# Altium project IoT Lock.PrjPcb
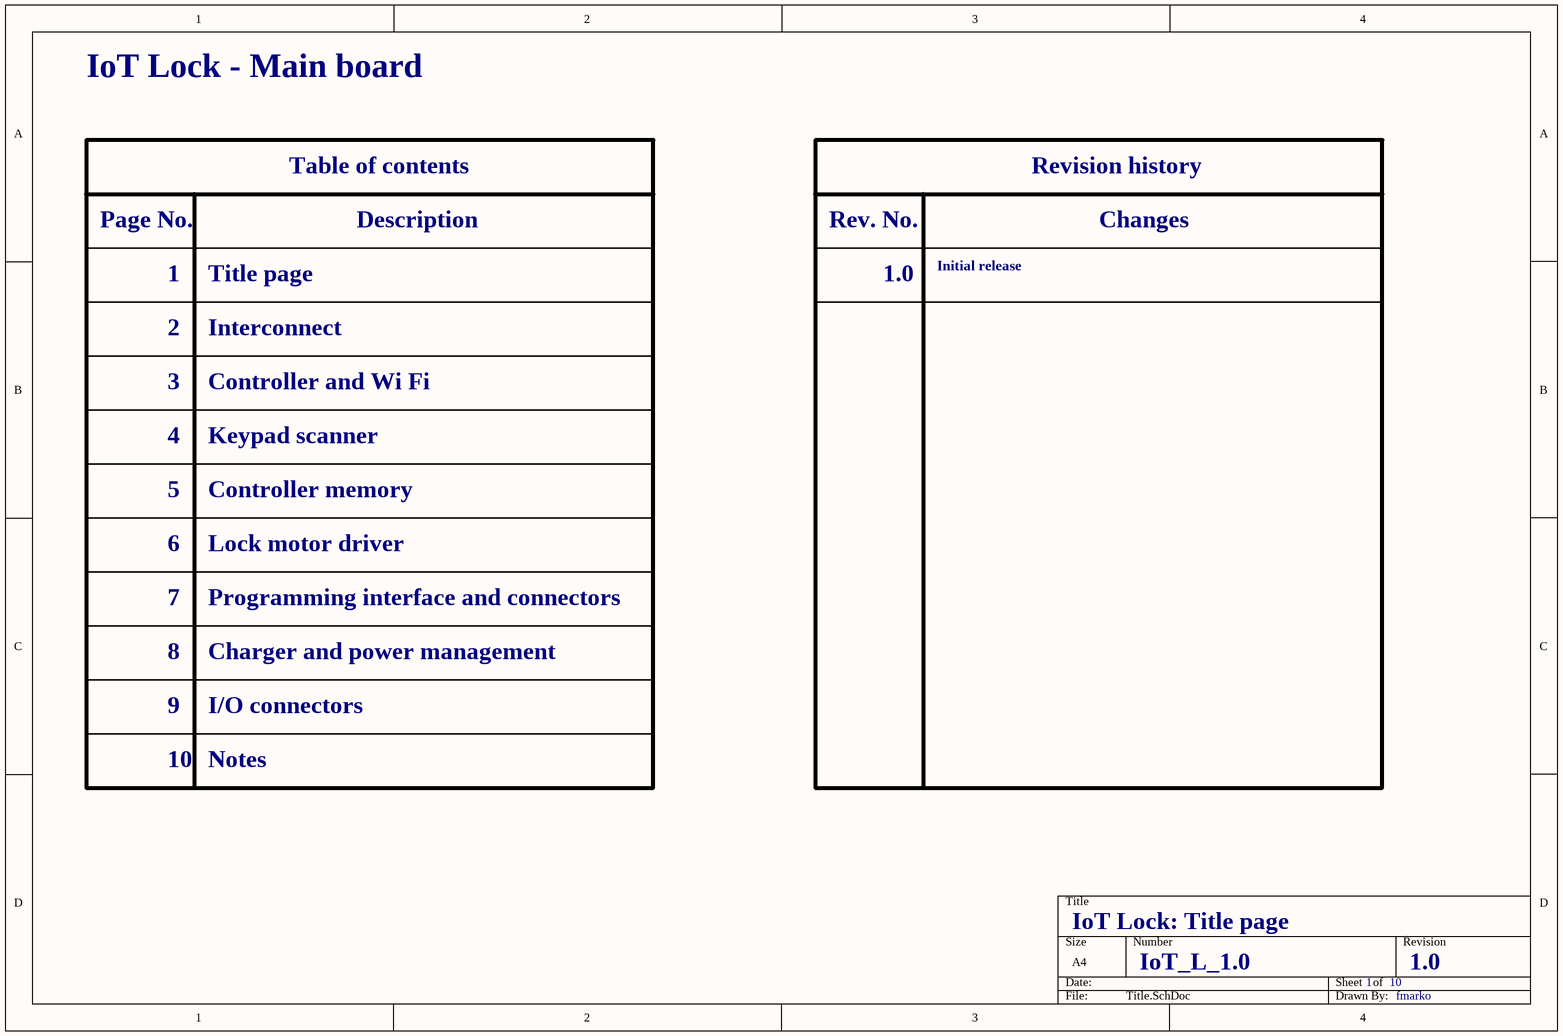
[diagram p0: Title.SchDoc]
10 sheets, 105 parts. Net scope: hierarchical (ports join the sheet entries above them; power ports are global).
Board file: PCB.PcbDoc
Sheets:
  Title.SchDoc
  Interconnect.SchDoc
    SH1 = Controller.SchDoc
    SH2 = Keypad Controller.SchDoc
    SH3 = Memory.SchDoc
    SH4 = Motor driver.SchDoc
    SH5 = Programming interface.SchDoc
    SH6 = Charger.SchDoc
    SH7 = Connectors.SchDoc
  Notes.SchDoc

## Sheet Title.SchDoc
size A4

### Notes on the sheet
- IoT Lock - Main board
- Table of contents
- Revision history
- Page No.
- Description
- Rev. No.
- Changes
- 1
- Title page
- 1.0
- Initial release
- 2
- Interconnect
- 3
- 4
- Controller and Wi Fi
- Keypad scanner
- 5
- Controller memory
- 6
- Lock motor driver
- 7
- Programming interface and connectors
- 8
- 9
- Charger and power management
- I/O connectors
- 10
- Notes
- IoT Lock: Title page
- IoT_L_1.0
- fmarko

## Sheet Interconnect.SchDoc
size A4
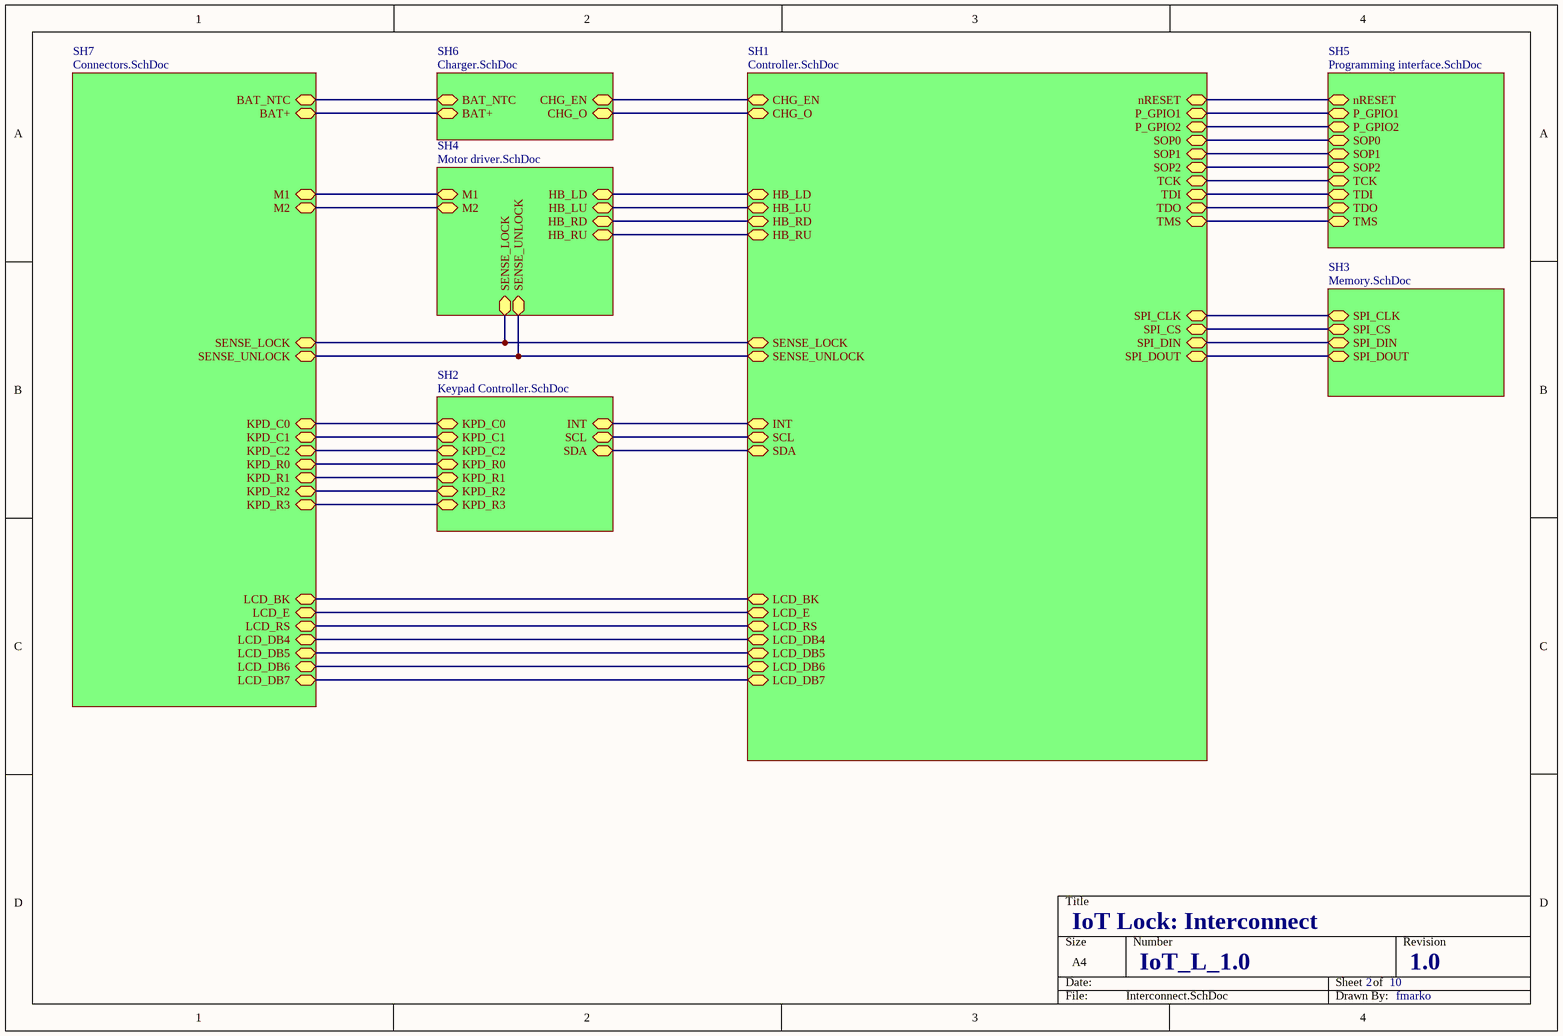
[diagram p1: Interconnect.SchDoc]

### Sub-sheets
SH1 = Controller.SchDoc: CHG_EN, CHG_O, HB_LD, HB_RD, HB_LU, HB_RU, INT, LCD_BK, LCD_DB4, LCD_DB5, LCD_DB6, LCD_DB7, LCD_E, LCD_RS, nRESET, P_GPIO1, P_GPIO2, SCL, SDA, SENSE_LOCK, SENSE_UNLOCK, SOP1, SOP0, SOP2, SPI_CLK, SPI_CS, SPI_DIN, SPI_DOUT, TCK, TDI, TDO, TMS
SH2 = Keypad Controller.SchDoc: INT, KPD_C0, KPD_C1, KPD_C2, KPD_R0, KPD_R1, KPD_R2, KPD_R3, SCL, SDA
SH3 = Memory.SchDoc: SPI_CLK, SPI_CS, SPI_DIN, SPI_DOUT
SH4 = Motor driver.SchDoc: HB_LD, HB_LU, HB_RD, HB_RU, M1, M2, SENSE_LOCK, SENSE_UNLOCK
SH5 = Programming interface.SchDoc: nRESET, P_GPIO1, P_GPIO2, SOP0, SOP2, SOP1, TCK, TDI, TDO, TMS
SH6 = Charger.SchDoc: BAT+, BAT_NTC, CHG_O, CHG_EN
SH7 = Connectors.SchDoc: BAT+, BAT_NTC, KPD_C0, KPD_C1, KPD_R0, KPD_C2, KPD_R1, KPD_R2, KPD_R3, LCD_BK, LCD_DB4, LCD_DB5, LCD_DB6, LCD_DB7, LCD_E, LCD_RS, M1, M2, SENSE_LOCK, SENSE_UNLOCK

### Nets
NetC29_2: sheet SH1/nRESET, sheet SH5/nRESET
NetC33_2: sheet SH6/BAT+, sheet SH7/BAT+
NetP1_3: sheet SH1/SOP0, sheet SH5/SOP0
NetP1_4: sheet SH1/SOP2, sheet SH5/SOP2
NetP1_5: sheet SH1/SOP1, sheet SH5/SOP1
NetP1_6: sheet SH1/P_GPIO2, sheet SH5/P_GPIO2
NetP1_7: sheet SH1/P_GPIO1, sheet SH5/P_GPIO1
NetP2_3: sheet SH1/TMS, sheet SH5/TMS
NetP2_4: sheet SH1/TCK, sheet SH5/TCK
NetP2_5: sheet SH1/TDO, sheet SH5/TDO
NetP2_7: sheet SH1/TDI, sheet SH5/TDI
NetP3_4: sheet SH1/LCD_RS, sheet SH7/LCD_RS
NetP3_6: sheet SH1/LCD_E, sheet SH7/LCD_E
NetP3_11: sheet SH1/LCD_DB4, sheet SH7/LCD_DB4
NetP3_12: sheet SH1/LCD_DB5, sheet SH7/LCD_DB5
NetP3_13: sheet SH1/LCD_DB6, sheet SH7/LCD_DB6
NetP3_14: sheet SH1/LCD_DB7, sheet SH7/LCD_DB7
NetP4_1: sheet SH2/KPD_C2, sheet SH7/KPD_C2
NetP4_2: sheet SH2/KPD_C1, sheet SH7/KPD_C1
NetP4_3: sheet SH2/KPD_C0, sheet SH7/KPD_C0
NetP4_4: sheet SH2/KPD_R0, sheet SH7/KPD_R0
NetP4_5: sheet SH2/KPD_R1, sheet SH7/KPD_R1
NetP4_6: sheet SH2/KPD_R2, sheet SH7/KPD_R2
NetP4_7: sheet SH2/KPD_R3, sheet SH7/KPD_R3
NetP5_2: sheet SH6/BAT_NTC, sheet SH7/BAT_NTC
NetP6_1: sheet SH4/M1, sheet SH7/M1
NetP6_2: sheet SH4/M2, sheet SH7/M2
NetP7_2: sheet SH1/SENSE_LOCK, sheet SH4/SENSE_LOCK, sheet SH7/SENSE_LOCK
NetP8_2: sheet SH1/SENSE_UNLOCK, sheet SH4/SENSE_UNLOCK, sheet SH7/SENSE_UNLOCK
NetR1_1: sheet SH1/INT, sheet SH2/INT
NetR2_1: sheet SH1/SDA, sheet SH2/SDA
NetR3_1: sheet SH1/SCL, sheet SH2/SCL
NetR16_1: sheet SH1/SPI_CS, sheet SH3/SPI_CS
NetR21_1: sheet SH1/HB_LD, sheet SH4/HB_LD
NetR22_2: sheet SH1/HB_RD, sheet SH4/HB_RD
NetR25_1: sheet SH1/CHG_O, sheet SH6/CHG_O
NetR31_1: sheet SH1/LCD_BK, sheet SH7/LCD_BK
NetT1_2: sheet SH1/HB_LU, sheet SH4/HB_LU
NetT2_2: sheet SH1/HB_RU, sheet SH4/HB_RU
NetU1_11: sheet SH1/SPI_CLK, sheet SH3/SPI_CLK
NetU1_12: sheet SH1/SPI_DOUT, sheet SH3/SPI_DOUT
NetU1_13: sheet SH1/SPI_DIN, sheet SH3/SPI_DIN
NetU1_50: sheet SH1/CHG_EN, sheet SH6/CHG_EN

### Notes on the sheet
- IoT Lock: Interconnect
- IoT_L_1.0
- 2
- 10
- 1.0
- fmarko

## Sheet Controller.SchDoc
size A4
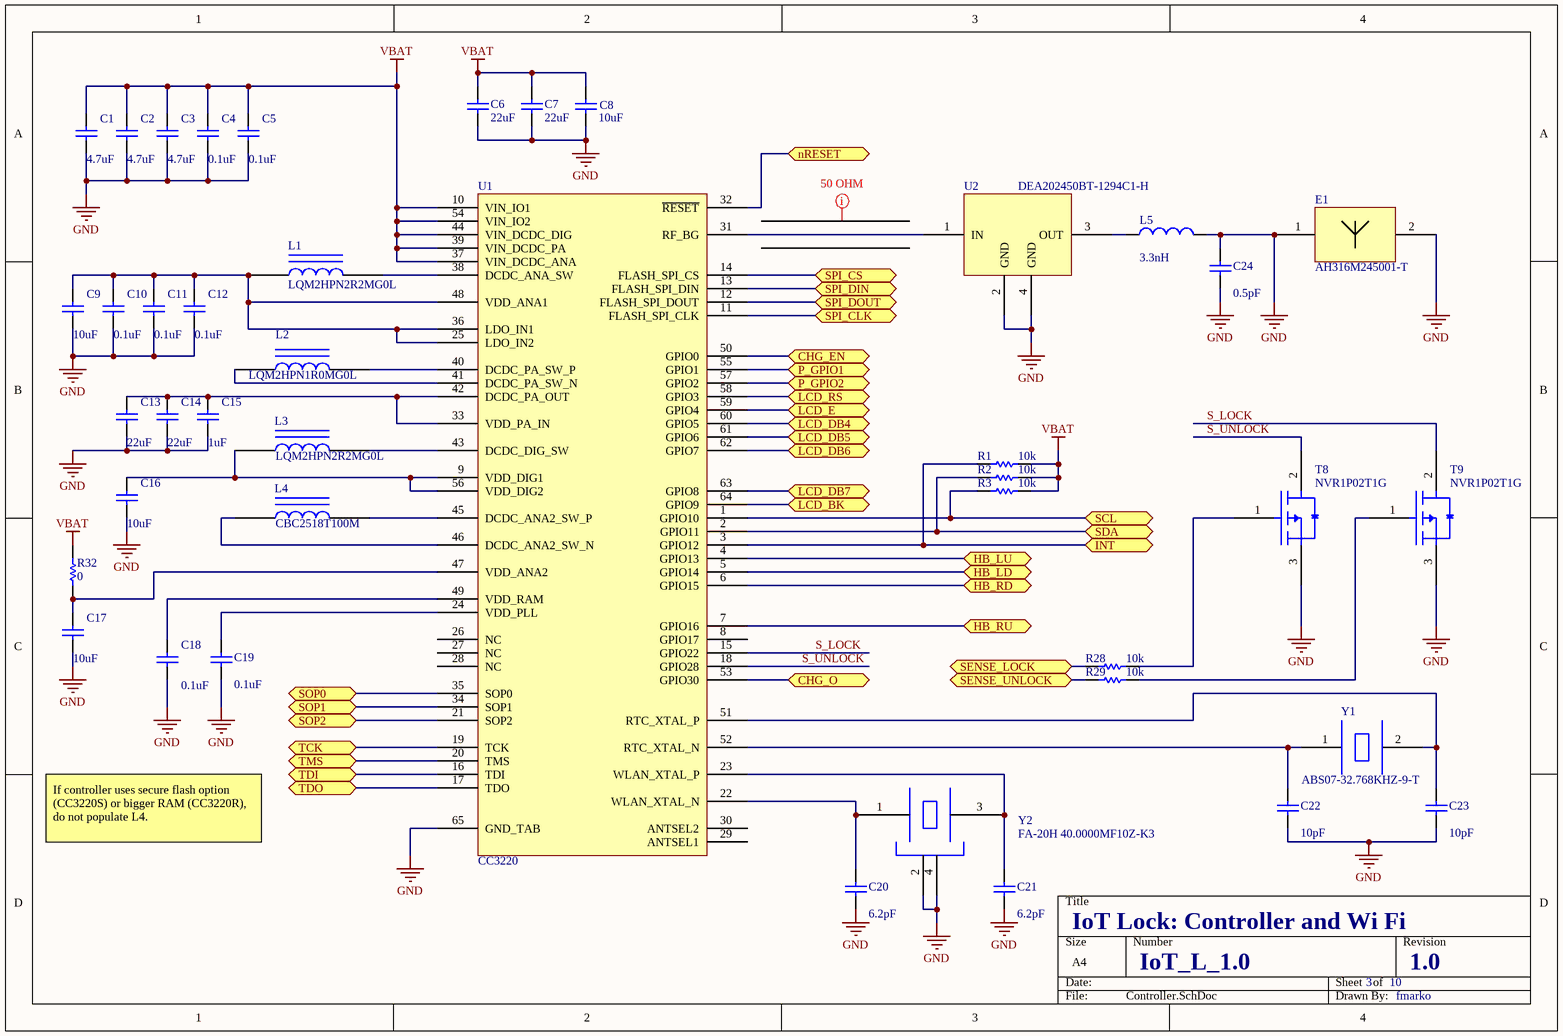
[diagram p2: Controller.SchDoc]

### Parts
C1  value 4.7uF  [0402]  (hidden comment: GRM1555C1HR50BA01D)
C2  value 4.7uF  [0402]  (hidden comment: GRM1555C1HR50BA01D)
C3  value 4.7uF  [0402]  (hidden comment: GRM1555C1HR50BA01D)
C4  value 0.1uF  [0402]  (hidden comment: GRM1555C1HR50BA01D)
C5  value 0.1uF  [0402]  (hidden comment: GRM1555C1HR50BA01D)
C6  value 22uF  [1608[0603]]  (hidden comment: GRM1555C1HR50BA01D)
C7  value 22uF  [1608[0603]]  (hidden comment: GRM1555C1HR50BA01D)
C8  value 10uF  [1608[0603]]  (hidden comment: GRM1555C1HR50BA01D)
C9  value 10uF  [1608[0603]]  (hidden comment: GRM1555C1HR50BA01D)
C10  value 0.1uF  [0402]  (hidden comment: GRM1555C1HR50BA01D)
C11  value 0.1uF  [0402]  (hidden comment: GRM1555C1HR50BA01D)
C12  value 0.1uF  [0402]  (hidden comment: GRM1555C1HR50BA01D)
C13  value 22uF  [1608[0603]]  (hidden comment: GRM1555C1HR50BA01D)
C14  value 22uF  [1608[0603]]  (hidden comment: GRM1555C1HR50BA01D)
C15  value 1uF  [0402]  (hidden comment: GRM1555C1HR50BA01D)
C16  value 10uF  [1608[0603]]  (hidden comment: GRM1555C1HR50BA01D)
C17  value 10uF  [1608[0603]]  (hidden comment: GRM1555C1HR50BA01D)
C18  value 0.1uF  [0402]  (hidden comment: GRM1555C1HR50BA01D)
C19  value 0.1uF  [0402]  (hidden comment: GRM1555C1HR50BA01D)
C20  value 6.2pF  [0402]  (hidden comment: GRM1555C1HR50BA01D)
C21  value 6.2pF  [0402]  (hidden comment: GRM1555C1HR50BA01D)
C22  value 10pF  [0402]  (hidden comment: GRM1555C1HR50BA01D)
C23  value 10pF  [0402]  (hidden comment: GRM1555C1HR50BA01D)
C24  value 0.5pF  [0402]  (hidden comment: GRM1555C1HR50BA01D)
E1  AH316M245001-T  [AH316M245001-T]
L1  LQM2HPN2R2MG0L  [INDC2520X10N]
L2  LQM2HPN1R0MG0L  [INDC2520X10N]
L3  LQM2HPN2R2MG0L  [INDC2520X10N]
L4  CBC2518T100M  [INDC2518X20N]
L5  value 3.3nH  [0402-A]  (hidden comment: LQG15HS3N3S02D)
R1  value 10k  [0402]  (hidden comment: Res Semi)
R2  value 10k  [0402]  (hidden comment: Res Semi)
R3  value 10k  [0402]  (hidden comment: Res Semi)
R28  value 10k  [0402]  (hidden comment: Res Semi)
R29  value 10k  [0402]  (hidden comment: Res Semi)
R32  value 0  [0402]  (hidden comment: Res Semi)
T8  NVR1P02T1G  [SOT95P237X111-3N]
T9  NVR1P02T1G  [SOT95P237X111-3N]
U1  CC3220  [PQFN50P900X900X100_HS-65N]
U2  DEA202450BT-1294C1-H  [DEA202450BT-1294C1-H_LAYOUT]
Y1  ABS07-32.768KHZ-9-T  [ABS07-32.768KHZ-9-T_HS]
Y2  FA-20H 40.0000MF10Z-K3  [FA-20H 40.0000MF10Z-K3_HS]

### Ports
CHG_EN, CHG_O, HB_LD, HB_LU, HB_RD, HB_RU, INT, LCD_BK, LCD_DB4, LCD_DB5, LCD_DB6, LCD_DB7, LCD_E, LCD_RS, nRESET, P_GPIO1, P_GPIO2, SCL, SDA, SENSE_LOCK, SENSE_UNLOCK, SOP0, SOP1, SOP2, SPI_CLK, SPI_CS, SPI_DIN, SPI_DOUT, TCK, TDI, TDO, TMS

### Nets
GND: C1.1 C2.1 C3.1 C4.1 C5.1 C6.1 C7.1 C8.1 C9.1 C10.1 C11.1 C12.1 C13.1 C14.1 C15.1 C16.1 C17.1 C18.1 C19.1 C20.1 C21.1 C22.1 C23.1 C24.1 C24.2 E1.1 E1.2 L5.2 T8.3(D) T9.3(D) U1.65(GND_TAB) U2.2(GND) U2.4(GND) Y2.2 Y2.4
VBAT: C1.2 C2.2 C3.2 C4.2 C5.2 C6.2 C7.2 C8.2 R1.2 R2.2 R3.2 R32.2 U1.10(VIN_IO1) U1.37(VIN_DCDC_ANA) U1.39(VIN_DCDC_PA) U1.44(VIN_DCDC_DIG) U1.54(VIN_IO2)
S_LOCK: T9.2(S) U1.15(GPIO22)
S_UNLOCK: T8.2(S) U1.18(GPIO28)
NetC9_2: C9.2 C10.2 C11.2 C12.2 L1.1 U1.25(LDO_IN2) U1.36(LDO_IN1) U1.48(VDD_ANA1)
NetC13_2: C13.2 C14.2 C15.2 U1.33(VDD_PA_IN) U1.42(DCDC_PA_OUT)
NetC16_2: C16.2 L3.1 U1.9(VDD_DIG1) U1.56(VDD_DIG2)
NetC17_2: C17.2 R32.1 U1.47(VDD_ANA2)
NetC18_2: C18.2 U1.49(VDD_RAM)
NetC19_2: C19.2 U1.24(VDD_PLL)
NetC20_2: C20.2 U1.22(WLAN_XTAL_N) Y2.1
NetC21_2: C21.2 U1.23(WLAN_XTAL_P) Y2.3
NetC22_2: C22.2 U1.52(RTC_XTAL_N) Y1.1
NetC23_2: C23.2 U1.51(RTC_XTAL_P) Y1.2
NetC29_2: U1.32(~{RESET}) ; port nRESET
NetL1_2: L1.2 U1.38(DCDC_ANA_SW)
NetL2_1: L2.1 U1.41(DCDC_PA_SW_N)
NetL2_2: L2.2 U1.40(DCDC_PA_SW_P)
NetL3_2: L3.2 U1.43(DCDC_DIG_SW)
NetL4_1: L4.1 U1.46(DCDC_ANA2_SW_N)
NetL4_2: L4.2 U1.45(DCDC_ANA2_SW_P)
NetL5_1: L5.1 U2.3(OUT)
NetP1_3: U1.35(SOP0) ; port SOP0
NetP1_4: U1.21(SOP2) ; port SOP2
NetP1_5: U1.34(SOP1) ; port SOP1
NetP1_6: U1.57(GPIO2) ; port P_GPIO2
NetP1_7: U1.55(GPIO1) ; port P_GPIO1
NetP2_3: U1.20(TMS) ; port TMS
NetP2_4: U1.19(TCK) ; port TCK
NetP2_5: U1.17(TDO) ; port TDO
NetP2_7: U1.16(TDI) ; port TDI
NetP3_4: U1.58(GPIO3) ; port LCD_RS
NetP3_6: U1.59(GPIO4) ; port LCD_E
NetP3_11: U1.60(GPIO5) ; port LCD_DB4
NetP3_12: U1.61(GPIO6) ; port LCD_DB5
NetP3_13: U1.62(GPIO7) ; port LCD_DB6
NetP3_14: U1.63(GPIO8) ; port LCD_DB7
NetP7_2: R28.1 ; port SENSE_LOCK
NetP8_2: R29.1 ; port SENSE_UNLOCK
NetR1_1: R1.1 U1.3(GPIO12) ; port INT
NetR2_1: R2.1 U1.2(GPIO11) ; port SDA
NetR3_1: R3.1 U1.1(GPIO10) ; port SCL
NetR16_1: U1.14(FLASH_SPI_CS) ; port SPI_CS
NetR21_1: U1.5(GPIO14) ; port HB_LD
NetR22_2: U1.6(GPIO15) ; port HB_RD
NetR25_1: U1.53(GPIO30) ; port CHG_O
NetR28_2: R28.2 T8.1(G)
NetR29_2: R29.2 T9.1(G)
NetR31_1: U1.64(GPIO9) ; port LCD_BK
NetT1_2: U1.4(GPIO13) ; port HB_LU
NetT2_2: U1.7(GPIO16) ; port HB_RU
NetU1_11: U1.11(FLASH_SPI_CLK) ; port SPI_CLK
NetU1_12: U1.12(FLASH_SPI_DOUT) ; port SPI_DOUT
NetU1_13: U1.13(FLASH_SPI_DIN) ; port SPI_DIN
NetU1_31: U1.31(RF_BG) U2.1(IN)
NetU1_50: U1.50(GPIO0) ; port CHG_EN

Not connected (* = marked no-connect by the designer): U1 8(GPIO17) 26(NC) 27(NC) 28(NC) 29(ANTSEL1) 30(ANTSEL2)

### Layout directives
rule Undefined: (no net found under the mark)

### Notes on the sheet
- If controller uses secure flash option (CC3220S) or bigger RAM (CC3220R),
  do not populate L4.
- IoT Lock: Controller and Wi Fi
- IoT_L_1.0
- 3
- 10
- 1.0
- fmarko

### Library data of the parts
C1-C24 = Cap: Capacitor; Published: 8-Jun-2000; LatestRevisionDate: 17-Jul-2002; LatestRevisionNote: Re-released for DXP Platform.; PackageReference: RAD-0.3; Publisher: Altium Limited; PackageDescription: Radial Cap, Thru-Hole; 2 Leads; 0.3 in Pin Spacing
E1 = AH316M245001-T: 2.4 GHz Antenna
L1-L3 = LQM2HPN2R2MG0L: Murata 2.2uH inductor
L4 = CBC2518T100M: 10 uH inductor, Taiyo Yuden
L5 = Inductor: Code_IEC: 1005; Published: 8-Jun-2000; LatestRevisionDate: 29-May-2009; LatestRevisionNote: IPC-7351 Footprint Added.; PackageReference: 0402-A; Publisher: Altium Limited; PackageDescription: Chip Inductor; Code_JEITA: 0402
R1-R3 R28 R29 R32 = Res Semi: Semiconductor Resistor; Published: 8-Jun-2000; LatestRevisionDate: 17-Jul-2002; LatestRevisionNote: Re-released for DXP Platform.; PackageReference: AXIAL-0.5; Publisher: Altium Limited; PackageDescription: Axial Device, Thru-Hole; 2 Leads; 0.5 in Pin Spacing
T8 T9 = NVR1P02T1G: P-Channel MOSFET
U1 = CC3220: WiFi IoT controller, TI
Y1 = ABS07-32.768KHZ-9-T: 32.768 kHz Crystal, Abracon LLC
Y2 = FA-20H 40.0000MF10Z-K3: Crystal, 40 MHz, 10pF, Epson

## Sheet Keypad Controller.SchDoc
size A4
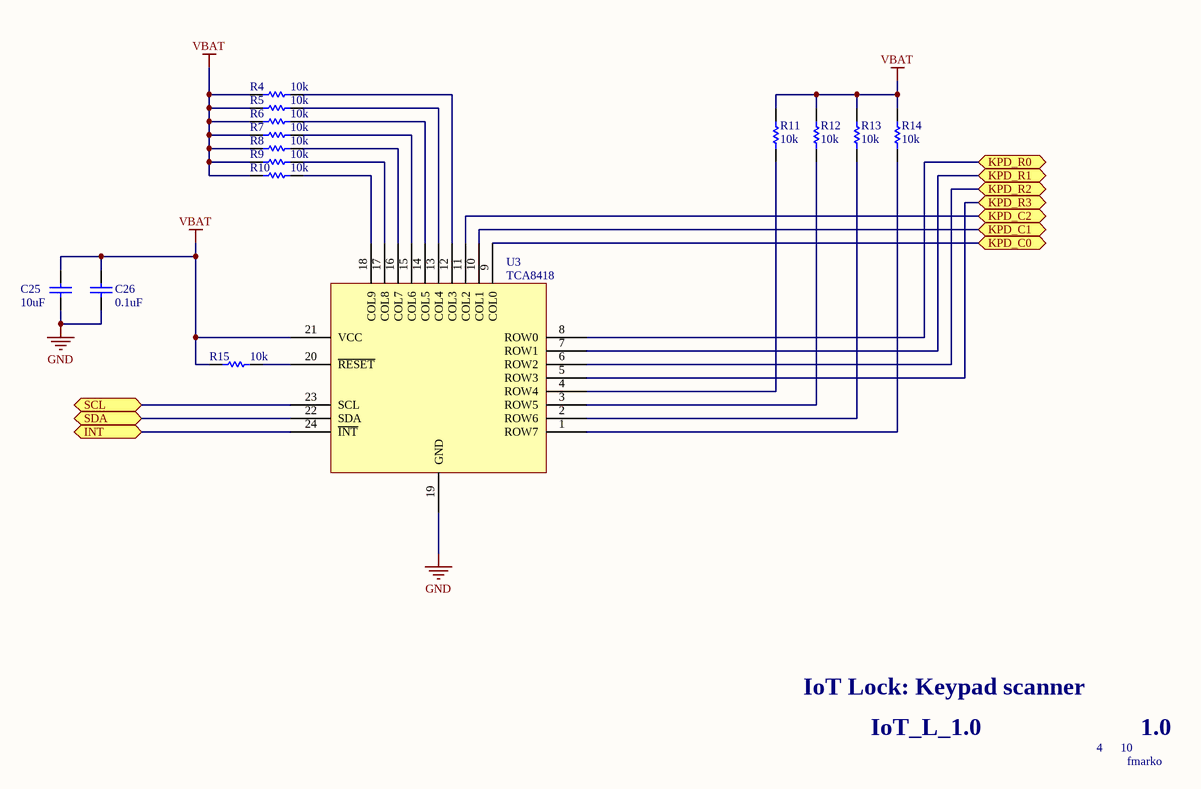
[diagram p3: Keypad Controller.SchDoc]

### Parts
C25  value 10uF  [1608[0603]]  (hidden comment: GRM1555C1HR50BA01D)
C26  value 0.1uF  [0402]  (hidden comment: GRM1555C1HR50BA01D)
R4  value 10k  [0402]  (hidden comment: Res Semi)
R5  value 10k  [0402]  (hidden comment: Res Semi)
R6  value 10k  [0402]  (hidden comment: Res Semi)
R7  value 10k  [0402]  (hidden comment: Res Semi)
R8  value 10k  [0402]  (hidden comment: Res Semi)
R9  value 10k  [0402]  (hidden comment: Res Semi)
R10  value 10k  [0402]  (hidden comment: Res Semi)
R11  value 10k  [0402]  (hidden comment: Res Semi)
R12  value 10k  [0402]  (hidden comment: Res Semi)
R13  value 10k  [0402]  (hidden comment: Res Semi)
R14  value 10k  [0402]  (hidden comment: Res Semi)
R15  value 10k  [0402]  (hidden comment: Res Semi)
U3  TCA8418  [PQFN50P400X400X80_HS-25N]

### Ports
INT, KPD_C0, KPD_C1, KPD_C2, KPD_R0, KPD_R1, KPD_R2, KPD_R3, SCL, SDA

### Nets
GND: C25.1 C26.1 U3.19(GND)
VBAT: C25.2 C26.2 R4.1 R5.1 R6.1 R7.1 R8.1 R9.1 R10.1 R11.2 R12.2 R13.2 R14.2 R15.1 U3.21(VCC)
NetP4_1: U3.11(COL2) ; port KPD_C2
NetP4_2: U3.10(COL1) ; port KPD_C1
NetP4_3: U3.9(COL0) ; port KPD_C0
NetP4_4: U3.8(ROW0) ; port KPD_R0
NetP4_5: U3.7(ROW1) ; port KPD_R1
NetP4_6: U3.6(ROW2) ; port KPD_R2
NetP4_7: U3.5(ROW3) ; port KPD_R3
NetR1_1: U3.24(~{INT}) ; port INT
NetR2_1: U3.22(SDA) ; port SDA
NetR3_1: U3.23(SCL) ; port SCL
NetR4_2: R4.2 U3.12(COL3)
NetR5_2: R5.2 U3.13(COL4)
NetR6_2: R6.2 U3.14(COL5)
NetR7_2: R7.2 U3.15(COL6)
NetR8_2: R8.2 U3.16(COL7)
NetR9_2: R9.2 U3.17(COL8)
NetR10_2: R10.2 U3.18(COL9)
NetR11_1: R11.1 U3.4(ROW4)
NetR12_1: R12.1 U3.3(ROW5)
NetR13_1: R13.1 U3.2(ROW6)
NetR14_1: R14.1 U3.1(ROW7)
NetR15_2: R15.2 U3.20(~{RESET})

### Notes on the sheet
- IoT Lock: Keypad scanner
- IoT_L_1.0
- 4
- 10
- 1.0
- fmarko

### Library data of the parts
C25 C26 = Cap: Capacitor; Published: 8-Jun-2000; LatestRevisionDate: 17-Jul-2002; LatestRevisionNote: Re-released for DXP Platform.; PackageReference: RAD-0.3; Publisher: Altium Limited; PackageDescription: Radial Cap, Thru-Hole; 2 Leads; 0.3 in Pin Spacing
R4-R15 = Res Semi: Semiconductor Resistor; Published: 8-Jun-2000; LatestRevisionDate: 17-Jul-2002; LatestRevisionNote: Re-released for DXP Platform.; PackageReference: AXIAL-0.5; Publisher: Altium Limited; PackageDescription: Axial Device, Thru-Hole; 2 Leads; 0.5 in Pin Spacing
U3 = TCA8418: I2C keyboard controller, TI

## Sheet Memory.SchDoc
size A4
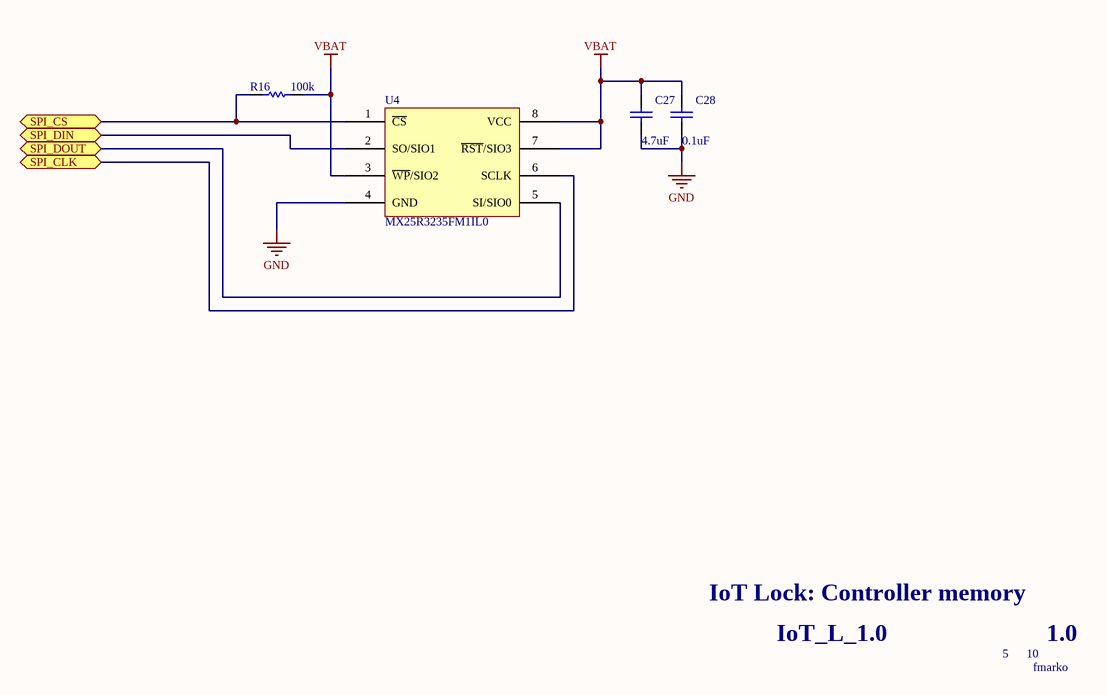
[diagram p4: Memory.SchDoc]

### Parts
C27  value 4.7uF  [0402]  (hidden comment: GRM1555C1HR50BA01D)
C28  value 0.1uF  [0402]  (hidden comment: GRM1555C1HR50BA01D)
R16  value 100k  [0402]  (hidden comment: Res Semi)
U4  MX25R3235FM1IL0  [SOP127P600X175-8N]

### Ports
SPI_CLK, SPI_CS, SPI_DIN, SPI_DOUT

### Nets
GND: C27.1 C28.1 U4.4(GND)
VBAT: C27.2 C28.2 R16.2 U4.3(~{WP}/SIO2) U4.7(~{RST}/SIO3) U4.8(VCC)
NetR16_1: R16.1 U4.1(~{CS}) ; port SPI_CS
NetU1_11: U4.6(SCLK) ; port SPI_CLK
NetU1_12: U4.5(SI/SIO0) ; port SPI_DOUT
NetU1_13: U4.2(SO/SIO1) ; port SPI_DIN

### Notes on the sheet
- IoT Lock: Controller memory
- IoT_L_1.0
- 5
- 10
- 1.0
- fmarko

### Library data of the parts
C27 C28 = Cap: Capacitor; Published: 8-Jun-2000; LatestRevisionDate: 17-Jul-2002; LatestRevisionNote: Re-released for DXP Platform.; PackageReference: RAD-0.3; Publisher: Altium Limited; PackageDescription: Radial Cap, Thru-Hole; 2 Leads; 0.3 in Pin Spacing
R16 = Res Semi: Semiconductor Resistor; Published: 8-Jun-2000; LatestRevisionDate: 17-Jul-2002; LatestRevisionNote: Re-released for DXP Platform.; PackageReference: AXIAL-0.5; Publisher: Altium Limited; PackageDescription: Axial Device, Thru-Hole; 2 Leads; 0.5 in Pin Spacing
U4 = MX25R3235FM1IL0: Macronix 32 Mbit SPI Flash memory

## Sheet Motor driver.SchDoc
size A4
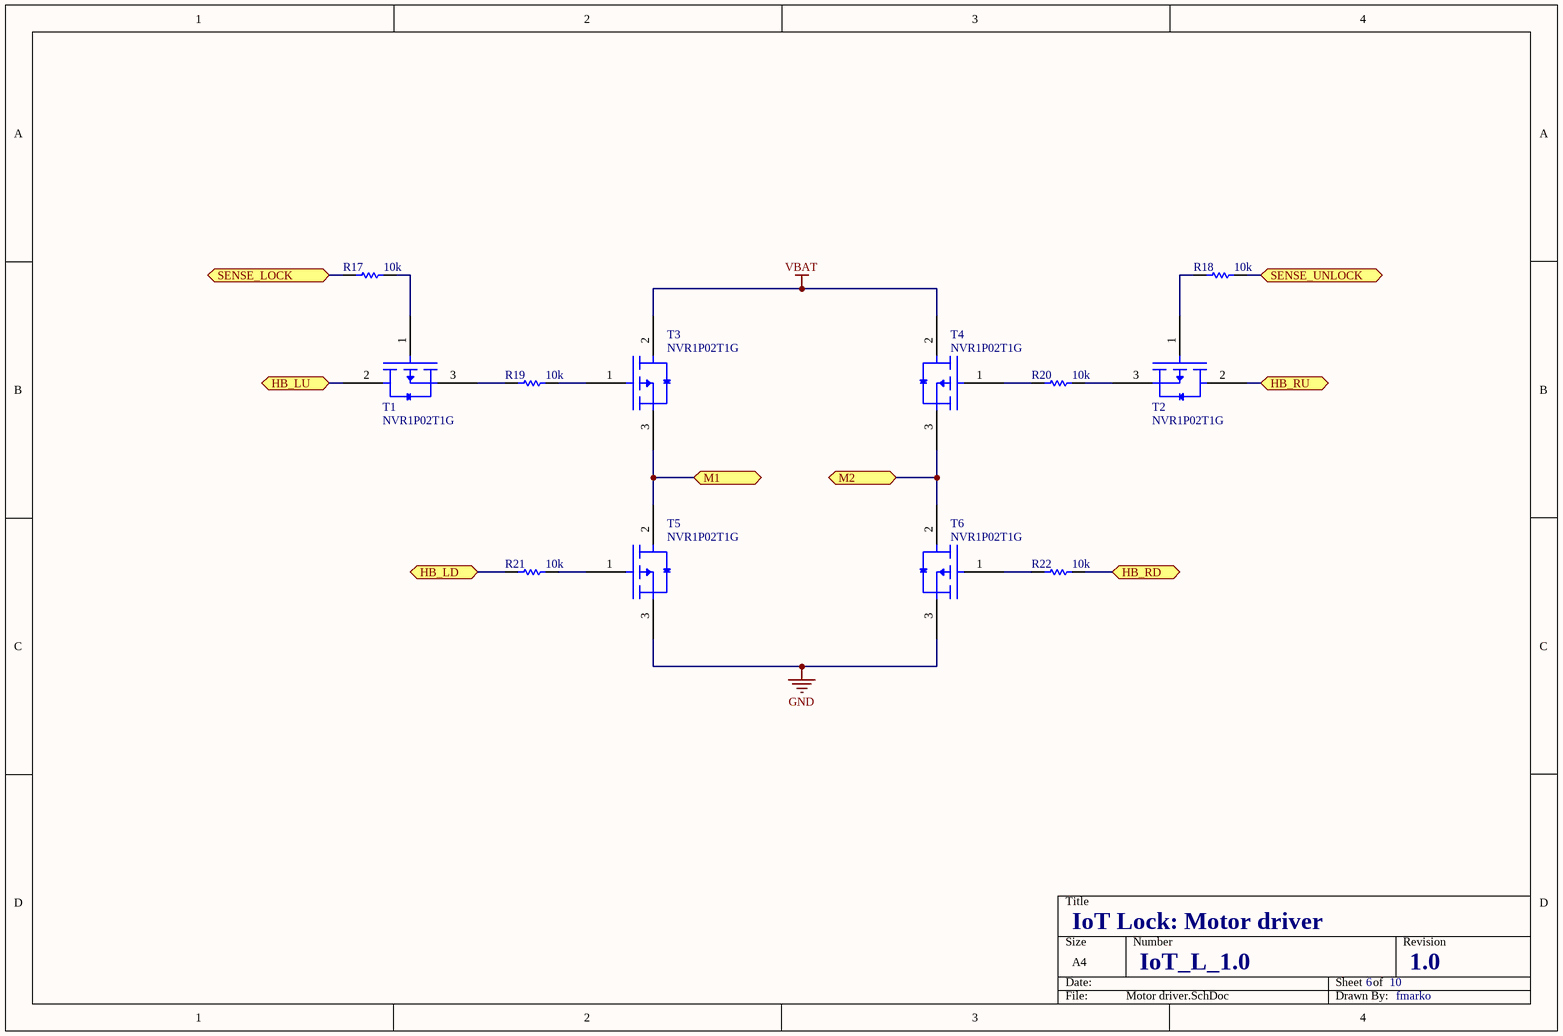
[diagram p5: Motor driver.SchDoc]

### Parts
R17  value 10k  [0402]  (hidden comment: Res Semi)
R18  value 10k  [0402]  (hidden comment: Res Semi)
R19  value 10k  [0402]  (hidden comment: Res Semi)
R20  value 10k  [0402]  (hidden comment: Res Semi)
R21  value 10k  [0402]  (hidden comment: Res Semi)
R22  value 10k  [0402]  (hidden comment: Res Semi)
T1  NVR1P02T1G  [SOT95P237X111-3N]
T2  NVR1P02T1G  [SOT95P237X111-3N]
T3  NVR1P02T1G  [SOT95P237X111-3N]
T4  NVR1P02T1G  [SOT95P237X111-3N]
T5  NVR1P02T1G  [SOT95P237X111-3N]
T6  NVR1P02T1G  [SOT95P237X111-3N]

### Ports
HB_LD, HB_LU, HB_RD, HB_RU, M1, M2, SENSE_LOCK, SENSE_UNLOCK

### Nets
GND: T5.3(D) T6.3(D)
VBAT: T3.2(S) T4.2(S)
NetP6_1: T3.3(D) T5.2(S) ; port M1
NetP6_2: T4.3(D) T6.2(S) ; port M2
NetP7_2: R17.1 ; port SENSE_LOCK
NetP8_2: R18.2 ; port SENSE_UNLOCK
NetR17_2: R17.2 T1.1(G)
NetR18_1: R18.1 T2.1(G)
NetR19_1: R19.1 T1.3(D)
NetR19_2: R19.2 T3.1(G)
NetR20_1: R20.1 T4.1(G)
NetR20_2: R20.2 T2.3(D)
NetR21_1: R21.1 ; port HB_LD
NetR21_2: R21.2 T5.1(G)
NetR22_1: R22.1 T6.1(G)
NetR22_2: R22.2 ; port HB_RD
NetT1_2: T1.2(S) ; port HB_LU
NetT2_2: T2.2(S) ; port HB_RU

### Notes on the sheet
- IoT Lock: Motor driver
- IoT_L_1.0
- 6
- 10
- 1.0
- fmarko

### Library data of the parts
R17-R22 = Res Semi: Semiconductor Resistor; Published: 8-Jun-2000; LatestRevisionDate: 17-Jul-2002; LatestRevisionNote: Re-released for DXP Platform.; PackageReference: AXIAL-0.5; Publisher: Altium Limited; PackageDescription: Axial Device, Thru-Hole; 2 Leads; 0.5 in Pin Spacing
T1-T6 = NVR1P02T1G: P-Channel MOSFET

## Sheet Programming interface.SchDoc
size A4
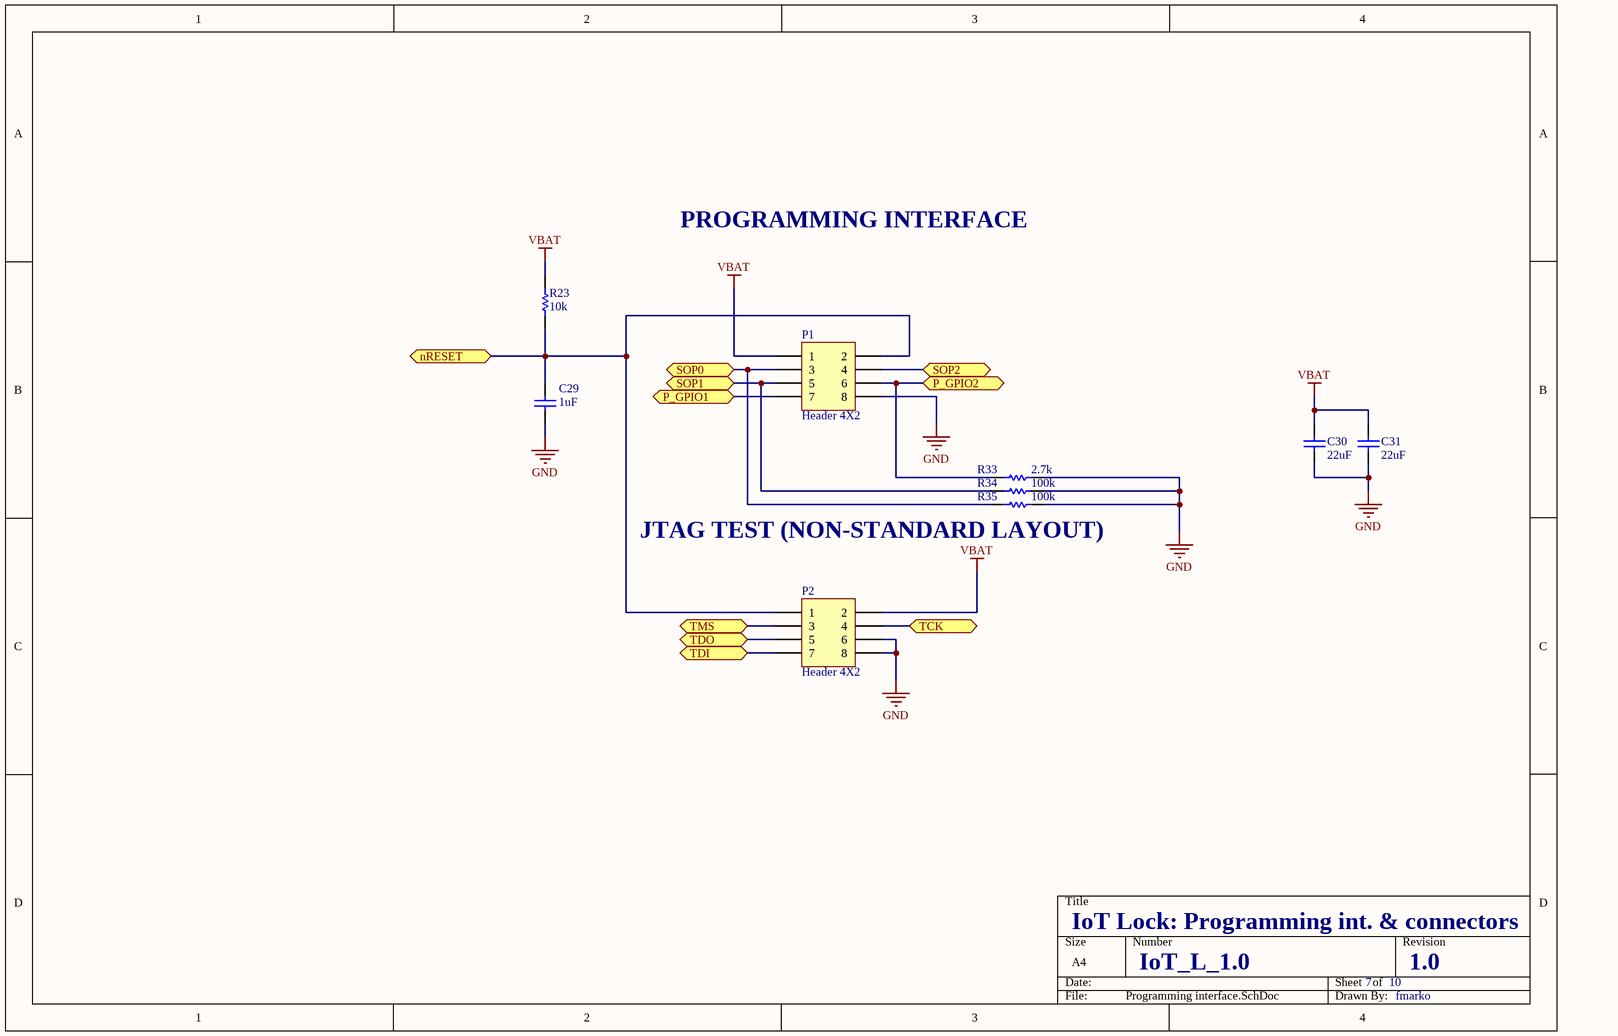
[diagram p6: Programming interface.SchDoc]

### Parts
C29  value 1uF  [0402]  (hidden comment: GRM1555C1HR50BA01D)
C30  value 22uF  [1608[0603]]  (hidden comment: GRM1555C1HR50BA01D)
C31  value 22uF  [1608[0603]]  (hidden comment: GRM1555C1HR50BA01D)
P1  Header 4X2  [HDR2X4]
P2  Header 4X2  [HDR2X4]
R23  value 10k  [0402]  (hidden comment: Res Semi)
R33  value 2.7k  [0402]  (hidden comment: Res Semi)
R34  value 100k  [0402]  (hidden comment: Res Semi)
R35  value 100k  [0402]  (hidden comment: Res Semi)

### Ports
nRESET, P_GPIO1, P_GPIO2, SOP0, SOP1, SOP2, TCK, TDI, TDO, TMS

### Nets
GND: C29.1 C30.1 C31.1 P1.8 P2.6 P2.8 R33.1 R34.1 R35.1
VBAT: C30.2 C31.2 P1.1 P2.2 R23.2
NetC29_2: C29.2 P1.2 P2.1 R23.1 ; port nRESET
NetP1_3: P1.3 R35.2 ; port SOP0
NetP1_4: P1.4 ; port SOP2
NetP1_5: P1.5 R34.2 ; port SOP1
NetP1_6: P1.6 R33.2 ; port P_GPIO2
NetP1_7: P1.7 ; port P_GPIO1
NetP2_3: P2.3 ; port TMS
NetP2_4: P2.4 ; port TCK
NetP2_5: P2.5 ; port TDO
NetP2_7: P2.7 ; port TDI

### Notes on the sheet
- PROGRAMMING INTERFACE
- (near R35) JTAG TEST (NON-STANDARD LAYOUT)
- IoT Lock: Programming int. & connectors
- IoT_L_1.0
- 7
- 10
- 1.0
- fmarko

### Library data of the parts
C29-C31 = Cap: Capacitor; Published: 8-Jun-2000; LatestRevisionDate: 17-Jul-2002; LatestRevisionNote: Re-released for DXP Platform.; PackageReference: RAD-0.3; Publisher: Altium Limited; PackageDescription: Radial Cap, Thru-Hole; 2 Leads; 0.3 in Pin Spacing
P1 P2 = Header 4X2: Header, 4-Pin, Dual row; LatestRevisionDate: 17-Jul-2002; LatestRevisionNote: Re-released for DXP Platform.; Publisher: Altium Limited
R23 R33-R35 = Res Semi: Semiconductor Resistor; Published: 8-Jun-2000; LatestRevisionDate: 17-Jul-2002; LatestRevisionNote: Re-released for DXP Platform.; PackageReference: AXIAL-0.5; Publisher: Altium Limited; PackageDescription: Axial Device, Thru-Hole; 2 Leads; 0.5 in Pin Spacing

## Sheet Charger.SchDoc
size A4
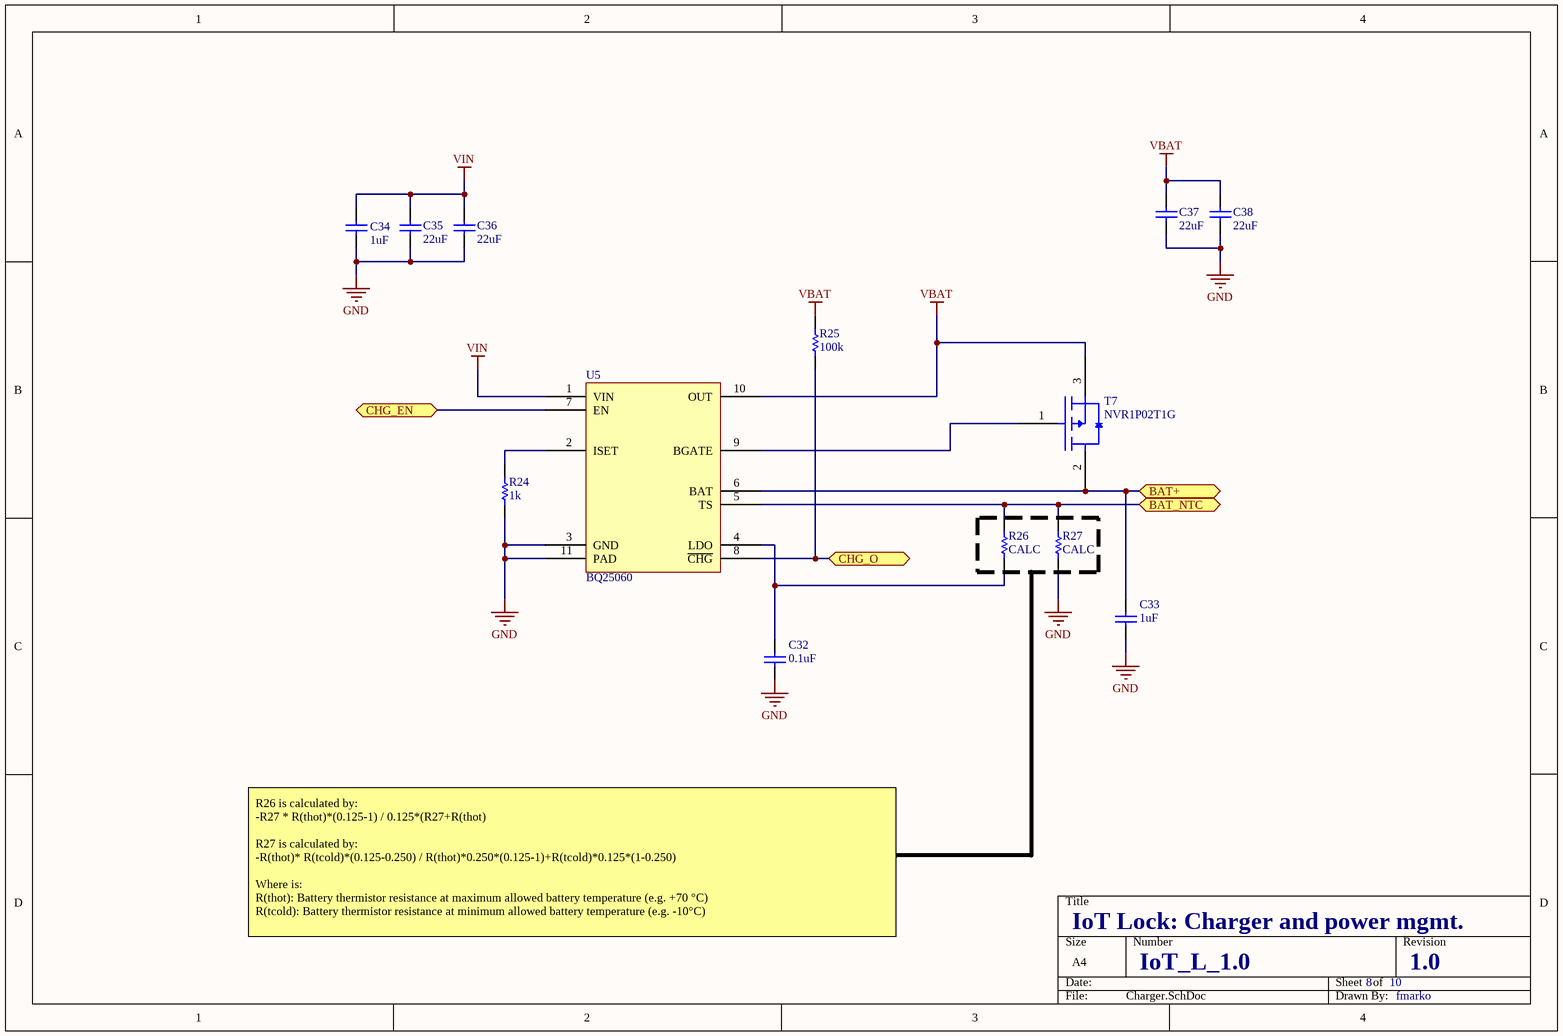
[diagram p7: Charger.SchDoc]

### Parts
C32  value 0.1uF  [0402]  (hidden comment: GRM1555C1HR50BA01D)
C33  value 1uF  [0402]  (hidden comment: GRM1555C1HR50BA01D)
C34  value 1uF  [0402]  (hidden comment: GRM1555C1HR50BA01D)
C35  value 22uF  [1608[0603]]  (hidden comment: GRM1555C1HR50BA01D)
C36  value 22uF  [1608[0603]]  (hidden comment: GRM1555C1HR50BA01D)
C37  value 22uF  [1608[0603]]  (hidden comment: GRM1555C1HR50BA01D)
C38  value 22uF  [1608[0603]]  (hidden comment: GRM1555C1HR50BA01D)
R24  value 1k  [0402]  (hidden comment: Res Semi)
R25  value 100k  [0402]  (hidden comment: Res Semi)
R26  value CALC  [0402]  (hidden comment: Res Semi)
R27  value CALC  [0402]  (hidden comment: Res Semi)
T7  NVR1P02T1G  [SOT95P237X111-3N]
U5  BQ25060  [SON50P200X80_HS-11N]

### Ports
BAT+, BAT_NTC, CHG_EN, CHG_O

### Nets
GND: C32.1 C33.1 C34.1 C35.1 C36.1 C37.1 C38.1 R24.1 R27.1 U5.3(GND) U5.11(PAD)
VBAT: C37.2 C38.2 R25.2 T7.3(D) U5.10(OUT)
VIN: C34.2 C35.2 C36.2 U5.1(VIN)
NetC32_2: C32.2 R26.1 U5.4(LDO)
NetC33_2: C33.2 T7.2(S) U5.6(BAT) ; port BAT+
NetP5_2: R26.2 R27.2 U5.5(TS) ; port BAT_NTC
NetR24_2: R24.2 U5.2(ISET)
NetR25_1: R25.1 U5.8(~{CHG}) ; port CHG_O
NetT7_1: T7.1(G) U5.9(BGATE)
NetU1_50: U5.7(EN) ; port CHG_EN

### Notes on the sheet
- R26 is calculated by:
  -R27 * R(thot)*(0.125-1) / 0.125*(R27+R(thot)
  R27 is calculated by:
  -R(thot)* R(tcold)*(0.125-0.250) / R(thot)*0.250*(0.125-1)+R(tcold)*0.125*(1-0.250)
  Where is:
  R(thot): Battery thermistor resistance at maximum allowed battery temperature (e.g. +70 °C)
  R(tcold): Battery thermistor resistance at minimum allowed battery temperature (e.g. -10°C)
  Check your battery specifications/datasheet
- IoT Lock: Charger and power mgmt.
- IoT_L_1.0
- 8
- 10
- 1.0
- fmarko

### Library data of the parts
C32-C38 = Cap: Capacitor; Published: 8-Jun-2000; LatestRevisionDate: 17-Jul-2002; LatestRevisionNote: Re-released for DXP Platform.; PackageReference: RAD-0.3; Publisher: Altium Limited; PackageDescription: Radial Cap, Thru-Hole; 2 Leads; 0.3 in Pin Spacing
R24-R27 = Res Semi: Semiconductor Resistor; Published: 8-Jun-2000; LatestRevisionDate: 17-Jul-2002; LatestRevisionNote: Re-released for DXP Platform.; PackageReference: AXIAL-0.5; Publisher: Altium Limited; PackageDescription: Axial Device, Thru-Hole; 2 Leads; 0.5 in Pin Spacing
T7 = NVR1P02T1G: P-Channel MOSFET
U5 = BQ25060: Li-Ion standalone charger, TI

## Sheet Connectors.SchDoc
size A4
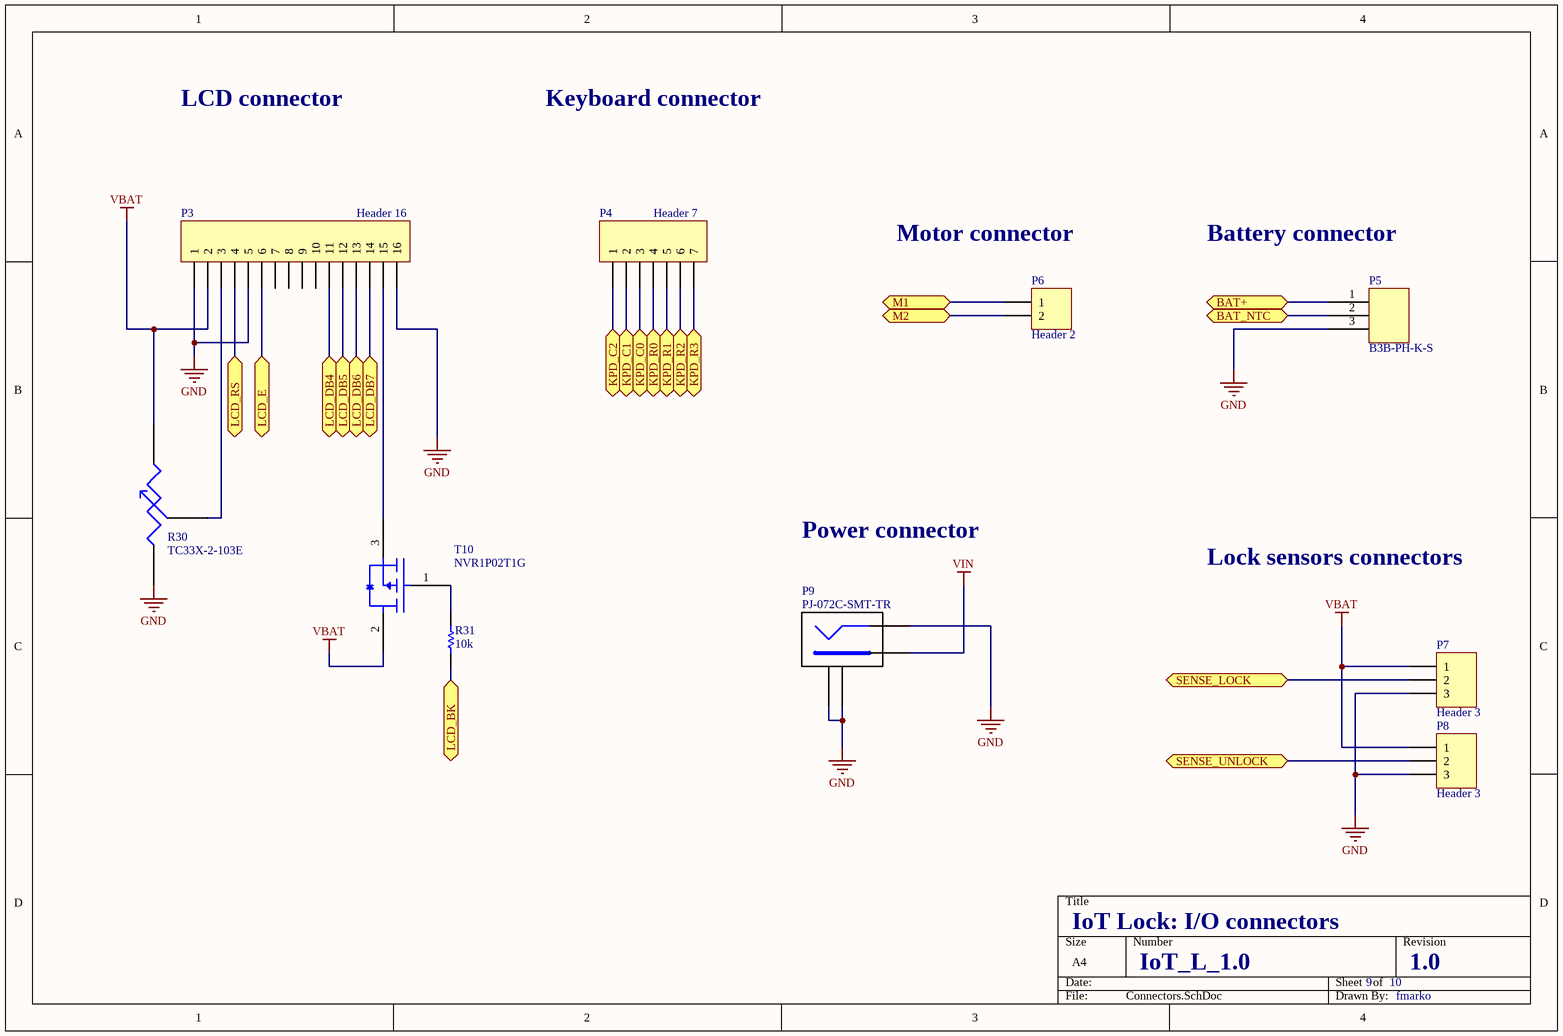
[diagram p8: Connectors.SchDoc]

### Parts
P3  Header 16  [HDR1X16]
P4  Header 7  [HDR1X7]
P5  B3B-PH-K-S  [B3B-PH-K-S]
P6  Header 2  [HDR1X2]
P7  Header 3  [HDR1X3]
P8  Header 3  [HDR1X3]
P9  PJ-072C-SMT-TR  [PJ-072C-SMT-TR_HOUSING]
R30  TC33X-2-103E  [TC33X-2-XXX_HOUSING]
R31  value 10k  [0402]  (hidden comment: Res Semi)
T10  NVR1P02T1G  [SOT95P237X111-3N]

### Ports
BAT+, BAT_NTC, KPD_C0, KPD_C1, KPD_C2, KPD_R0, KPD_R1, KPD_R2, KPD_R3, LCD_BK, LCD_DB4, LCD_DB5, LCD_DB6, LCD_DB7, LCD_E, LCD_RS, M1, M2, SENSE_LOCK, SENSE_UNLOCK

### Nets
GND: P3.1 P3.5 P3.16 P5.3 P7.3 P8.3 P9.2(GND) P9.3(SHD) P9.4(SHD) R30.1
VBAT: P3.2 P7.1 P8.1 R30.3 T10.2(S)
VIN: P9.1(PWR)
NetC33_2: P5.1 ; port BAT+
NetP3_3: P3.3 R30.2
NetP3_4: P3.4 ; port LCD_RS
NetP3_6: P3.6 ; port LCD_E
NetP3_11: P3.11 ; port LCD_DB4
NetP3_12: P3.12 ; port LCD_DB5
NetP3_13: P3.13 ; port LCD_DB6
NetP3_14: P3.14 ; port LCD_DB7
NetP3_15: P3.15 T10.3(D)
NetP4_1: P4.1 ; port KPD_C2
NetP4_2: P4.2 ; port KPD_C1
NetP4_3: P4.3 ; port KPD_C0
NetP4_4: P4.4 ; port KPD_R0
NetP4_5: P4.5 ; port KPD_R1
NetP4_6: P4.6 ; port KPD_R2
NetP4_7: P4.7 ; port KPD_R3
NetP5_2: P5.2 ; port BAT_NTC
NetP6_1: P6.1 ; port M1
NetP6_2: P6.2 ; port M2
NetP7_2: P7.2 ; port SENSE_LOCK
NetP8_2: P8.2 ; port SENSE_UNLOCK
NetR31_1: R31.1 ; port LCD_BK
NetR31_2: R31.2 T10.1(G)

Not connected (* = marked no-connect by the designer): P3 7 8 9 10

### Notes on the sheet
- LCD connector
- Keyboard connector
- Motor connector
- Battery connector
- Power connector
- Lock sensors connectors
- IoT Lock: I/O connectors
- IoT_L_1.0
- 9
- 10
- 1.0
- fmarko

### Library data of the parts
P3 = Header 16: Header, 16-Pin; LatestRevisionDate: 17-Jul-2002; LatestRevisionNote: Re-released for DXP Platform.; Publisher: Altium Limited
P4 = Header 7: Header, 7-Pin; LatestRevisionDate: 17-Jul-2002; LatestRevisionNote: Re-released for DXP Platform.; Publisher: Altium Limited
P5 = B3B-PH-K-S: JST connector, 3-pin, 2mm pitch
P6 = Header 2: Header, 2-Pin; LatestRevisionDate: 17-Jul-2002; LatestRevisionNote: Re-released for DXP Platform.; Publisher: Altium Limited
P7 P8 = Header 3: Header, 3-Pin; LatestRevisionDate: 17-Jul-2002; LatestRevisionNote: Re-released for DXP Platform.; Publisher: Altium Limited
P9 = PJ-072C-SMT-TR: CUI Barrel power connector, 1X3.4mm
R30 = TC33X-2-103E: SMD trimmer resistor, 10k
R31 = Res Semi: Semiconductor Resistor; Published: 8-Jun-2000; LatestRevisionDate: 17-Jul-2002; LatestRevisionNote: Re-released for DXP Platform.; PackageReference: AXIAL-0.5; Publisher: Altium Limited; PackageDescription: Axial Device, Thru-Hole; 2 Leads; 0.5 in Pin Spacing
T10 = NVR1P02T1G: P-Channel MOSFET

## Sheet Notes.SchDoc
size A4
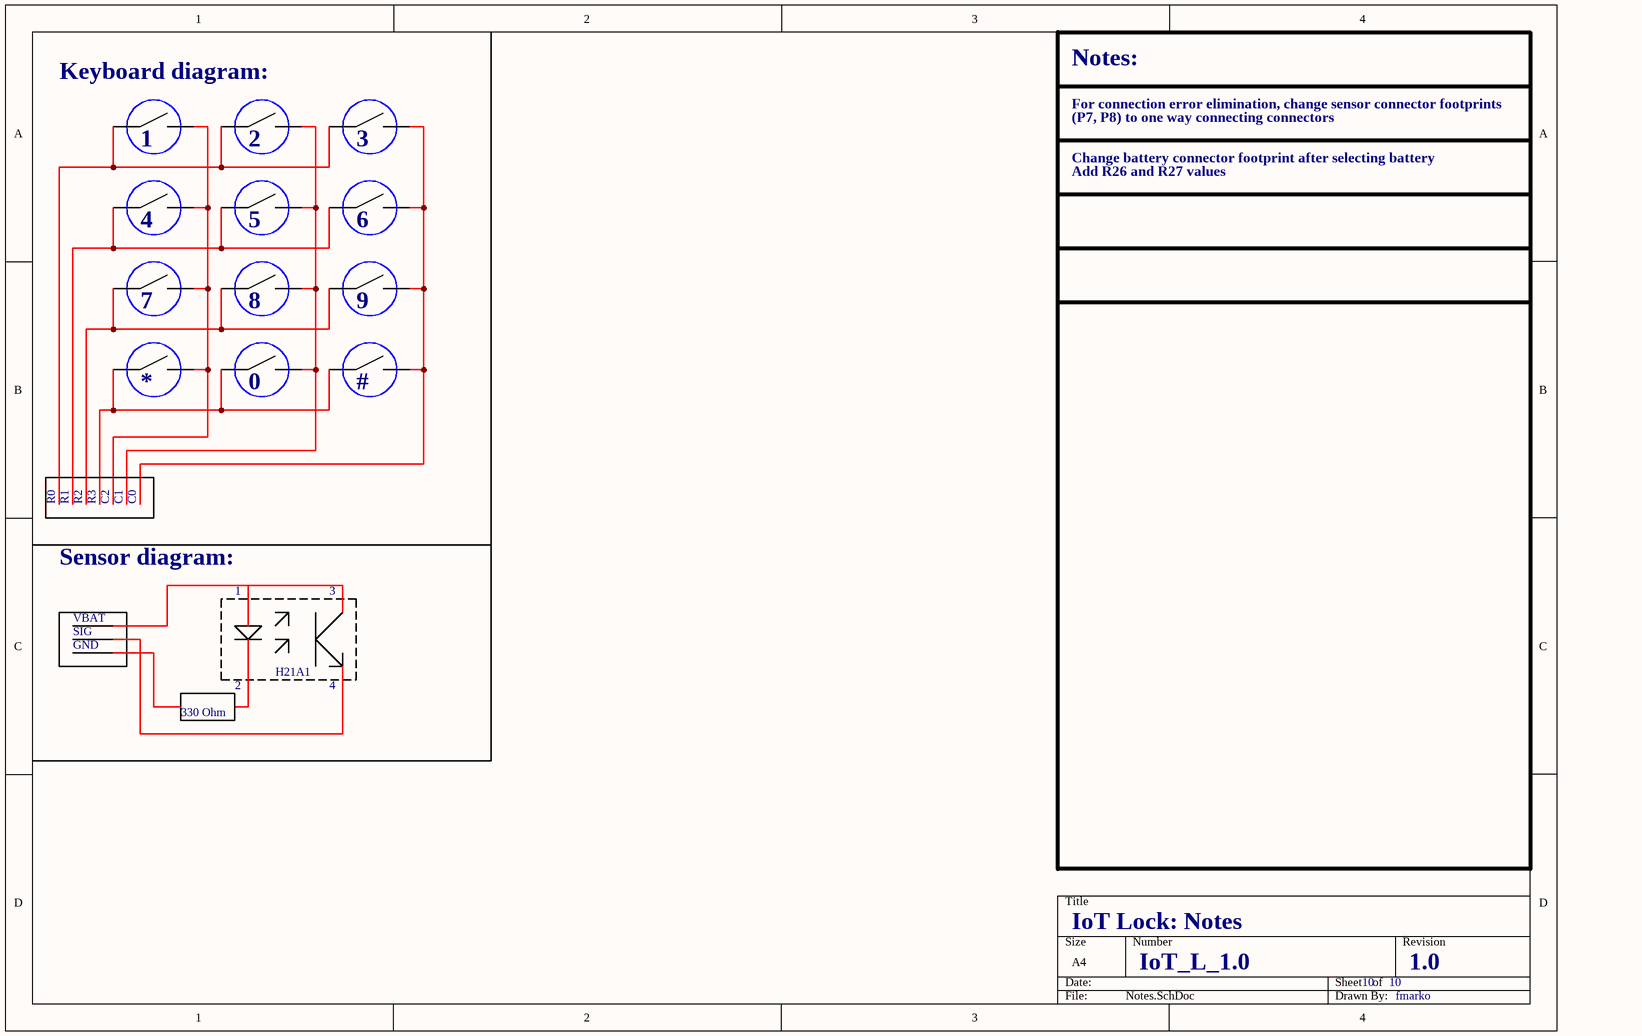
[diagram p9: Notes.SchDoc]

### Notes on the sheet
- Keyboard diagram:
- Notes:
- For connection error elimination, change sensor connector footprints
- 1
- 2
- 3
- (P7, P8) to one way connecting connectors
- Change battery connector footprint after selecting battery
- Add R26 and R27 values
- 4
- 5
- 6
- 7
- 8
- 9
- *
- 0
- #
- R0
- R1
- R2
- R3
- C2
- C1
- C0
- Sensor diagram:
- VBAT
- SIG
- GND
- 330 Ohm
- H21A1
- IoT Lock: Notes
- IoT_L_1.0
- 10
- 1.0
- fmarko

## Nets that join several sheets
GND: Controller (35 pins), Keypad Controller (C25.1 C26.1 U3.19), Memory (C27.1 C28.1 U4.4), Motor driver (T5.3 T6.3), Programming interface (9 pins), Charger (11 pins), Connectors (10 pins)
VBAT: Controller (17 pins), Keypad Controller (15 pins), Memory (6 pins), Motor driver (T3.2 T4.2), Programming interface (5 pins), Charger (5 pins), Connectors (5 pins)
VIN: Charger (C34.2 C35.2 C36.2 U5.1), Connectors (P9.1)
NetC29_2: Controller (U1.32), Programming interface (C29.2 P1.2 P2.1 R23.1)
NetC33_2: Charger (C33.2 T7.2 U5.6), Connectors (P5.1)
NetP1_3: Controller (U1.35), Programming interface (P1.3 R35.2)
NetP1_4: Controller (U1.21), Programming interface (P1.4)
NetP1_5: Controller (U1.34), Programming interface (P1.5 R34.2)
NetP1_6: Controller (U1.57), Programming interface (P1.6 R33.2)
NetP1_7: Controller (U1.55), Programming interface (P1.7)
NetP2_3: Controller (U1.20), Programming interface (P2.3)
NetP2_4: Controller (U1.19), Programming interface (P2.4)
NetP2_5: Controller (U1.17), Programming interface (P2.5)
NetP2_7: Controller (U1.16), Programming interface (P2.7)
NetP3_4: Controller (U1.58), Connectors (P3.4)
NetP3_6: Controller (U1.59), Connectors (P3.6)
NetP3_11: Controller (U1.60), Connectors (P3.11)
NetP3_12: Controller (U1.61), Connectors (P3.12)
NetP3_13: Controller (U1.62), Connectors (P3.13)
NetP3_14: Controller (U1.63), Connectors (P3.14)
NetP4_1: Keypad Controller (U3.11), Connectors (P4.1)
NetP4_2: Keypad Controller (U3.10), Connectors (P4.2)
NetP4_3: Keypad Controller (U3.9), Connectors (P4.3)
NetP4_4: Keypad Controller (U3.8), Connectors (P4.4)
NetP4_5: Keypad Controller (U3.7), Connectors (P4.5)
NetP4_6: Keypad Controller (U3.6), Connectors (P4.6)
NetP4_7: Keypad Controller (U3.5), Connectors (P4.7)
NetP5_2: Charger (R26.2 R27.2 U5.5), Connectors (P5.2)
NetP6_1: Motor driver (T3.3 T5.2), Connectors (P6.1)
NetP6_2: Motor driver (T4.3 T6.2), Connectors (P6.2)
NetP7_2: Controller (R28.1), Motor driver (R17.1), Connectors (P7.2)
NetP8_2: Controller (R29.1), Motor driver (R18.2), Connectors (P8.2)
NetR1_1: Controller (R1.1 U1.3), Keypad Controller (U3.24)
NetR2_1: Controller (R2.1 U1.2), Keypad Controller (U3.22)
NetR3_1: Controller (R3.1 U1.1), Keypad Controller (U3.23)
NetR16_1: Controller (U1.14), Memory (R16.1 U4.1)
NetR21_1: Controller (U1.5), Motor driver (R21.1)
NetR22_2: Controller (U1.6), Motor driver (R22.2)
NetR25_1: Controller (U1.53), Charger (R25.1 U5.8)
NetR31_1: Controller (U1.64), Connectors (R31.1)
NetT1_2: Controller (U1.4), Motor driver (T1.2)
NetT2_2: Controller (U1.7), Motor driver (T2.2)
NetU1_11: Controller (U1.11), Memory (U4.6)
NetU1_12: Controller (U1.12), Memory (U4.5)
NetU1_13: Controller (U1.13), Memory (U4.2)
NetU1_50: Controller (U1.50), Charger (U5.7)